# Altium schematic sheet Limit Sensor Interface.SchDoc
size C
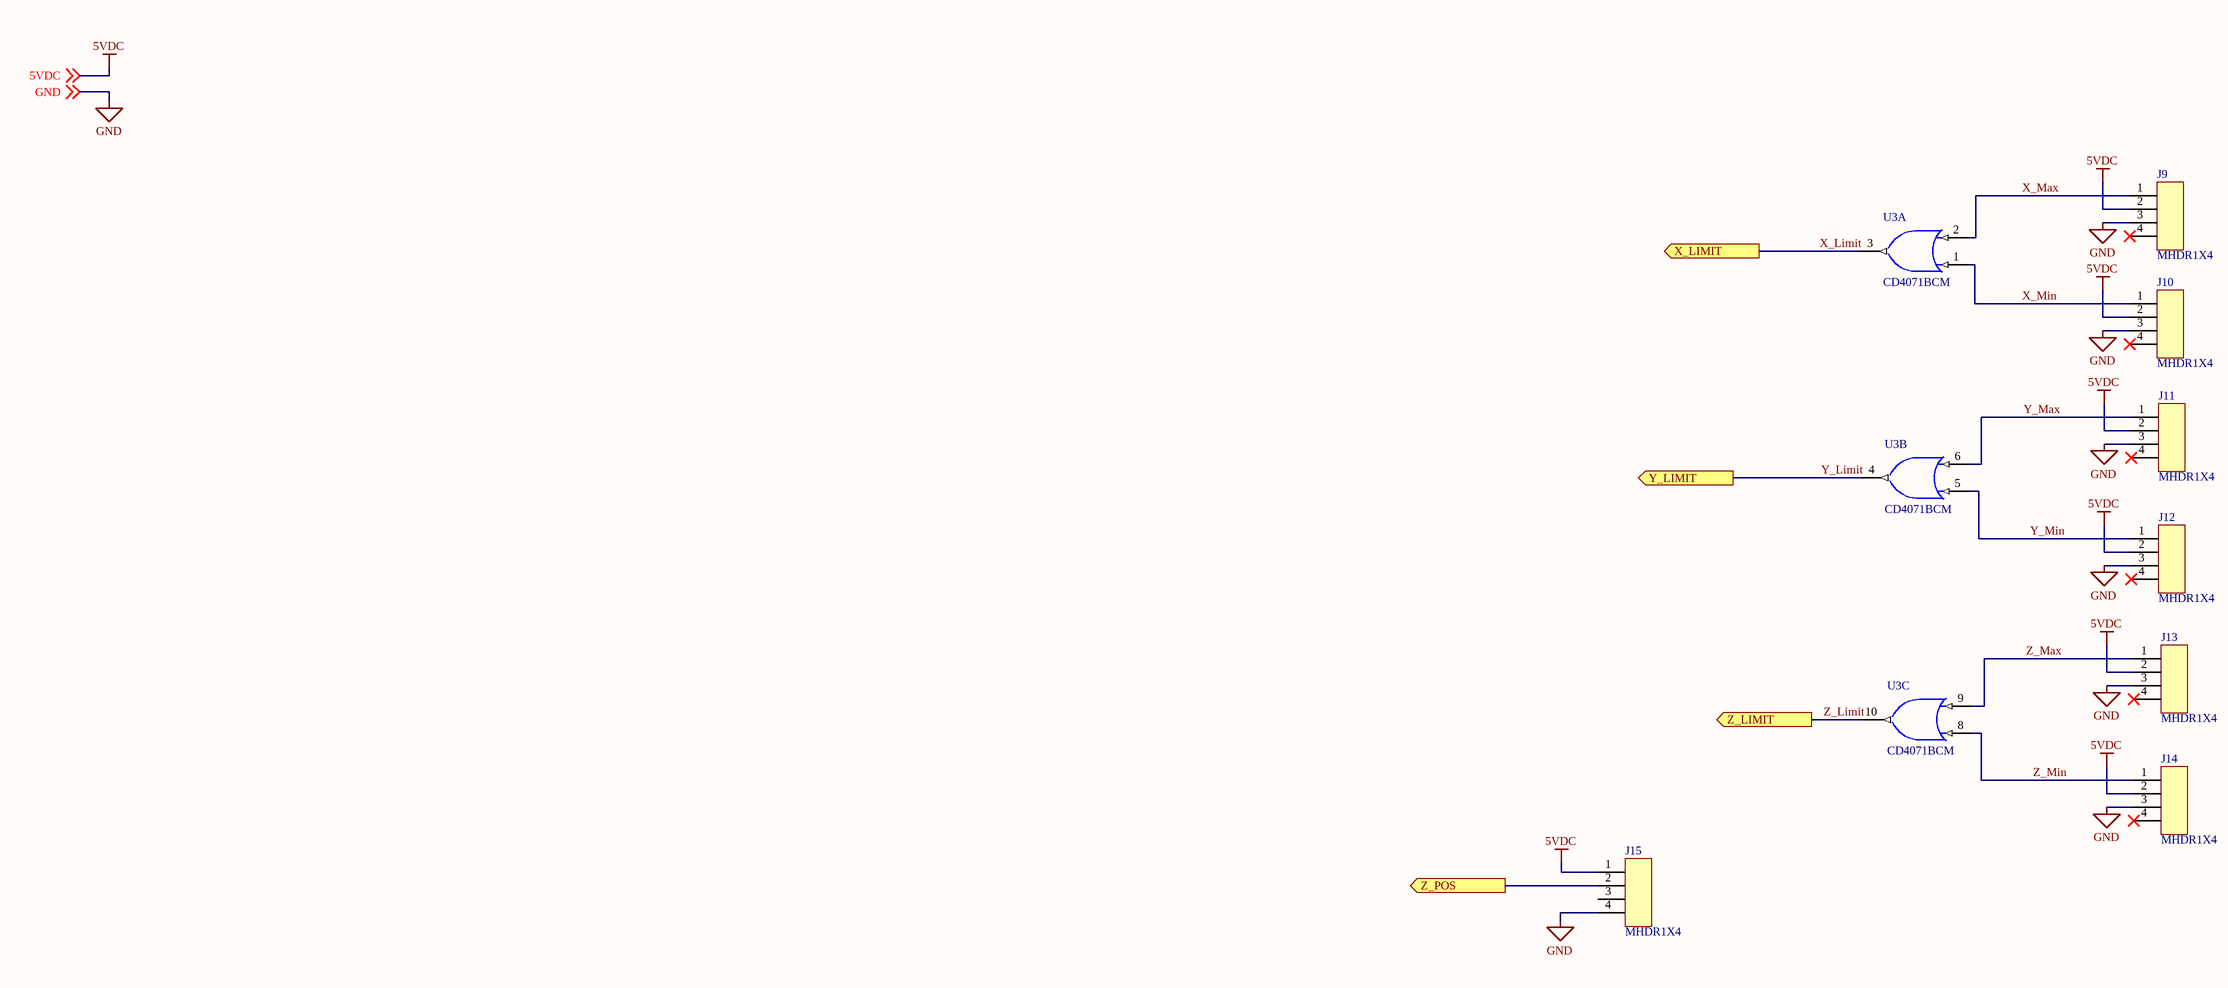
[diagram p0: Limit Sensor Interface.SchDoc]

## Parts
?  (no value)  (graphical)
J9  MHDR1X4  [HDR1X4]
J10  MHDR1X4  [HDR1X4]
J11  MHDR1X4  [HDR1X4]
J12  MHDR1X4  [HDR1X4]
J13  MHDR1X4  [HDR1X4]
J14  MHDR1X4  [HDR1X4]
J15  MHDR1X4  [HDR1X4]
U3  CD4071BCM  [M14A_N]  (parts A,B,C of 4)

## Ports
X_LIMIT (out), Y_LIMIT (out), Z_LIMIT (out), Z_POS (out)

## Nets
5VDC: J9.2 J10.2 J11.2 J12.2 J13.2 J14.2 J15.1 ; off-sheet 5VDC
GND: J9.3 J10.3 J11.3 J12.3 J13.3 J14.3 J15.4 U3.7(GND) ; off-sheet GND
VDD: U3.14(VDD)
X_Limit: U3.3(J) ; port X_LIMIT
X_Max: J9.1 U3.2(B)
X_Min: J10.1 U3.1(A)
Y_Limit: U3.4(J) ; port Y_LIMIT
Y_Max: J11.1 U3.6(B)
Y_Min: J12.1 U3.5(A)
Z_Limit: U3.10(J) ; port Z_LIMIT
Z_Max: J13.1 U3.9(B)
Z_Min: J14.1 U3.8(A)
Z_POS: J15.2 ; port Z_POS

Not connected (* = marked no-connect by the designer): J9 4*; J10 4*; J11 4*; J12 4*; J13 4*; J14 4*; J15 3

## Notes on the sheet
- Title
- Size
- Date:
- Document Number
- Sheet
- of
- Rev

## Library data of the parts
? = Title Block Standard
J9-J15 = MHDR1X4: Header, 4-Pin; LatestRevisionDate: 17-Jul-2002; LatestRevisionNote: Re-released for DXP Platform.; Publisher: Altium Limited
U3 = CD4071BCM: Quad 2-Input OR Buffered B series Gate, 14-Pin SOIC; IC_Technology: C; Published: 17-Jul-2002; LatestRevisionDate: 13-Apr-2006; LatestRevisionNote: IPC-7351 Footprint Added.; DatasheetVersion: Jan-1999; PackageVersion: 2000; PackageReference: M14A; Publisher: Altium Limited; PackageDescription: 14-Pin Small Outline Integrated Circuit 1.27 mm Pitch; Code_IPC: SOIC127P600-14; ComponentLink1Description: Manufacturer Link; ComponentLink1URL: http://www.fairchildsemi.com/; ComponentLink2Description: Datasheet; ComponentLink2URL: http://www.fairchildsemi.com/ds/CD%2FCD4071BC.pdf